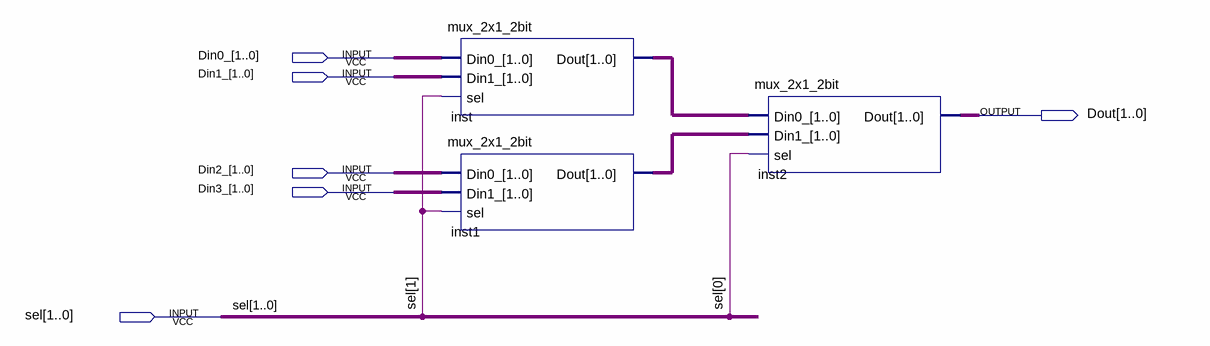
[diagram p0: schematic sheet]
// Quartus schematic mux_4x1_2bit.bdf as structural Verilog: 3 symbols, 6 pins
module mux_4x1_2bit (
  input  [1:0] Din0_,
  input  [1:0] Din1_,
  input  [1:0] Din2_,
  input  [1:0] Din3_,
  input  [1:0] sel,
  output [1:0] Dout
);

  wire [1:0] inst1_dout, inst_dout;

  mux_2x1_2bit inst (.Din0_(Din0_), .Din1_(Din1_), .sel(sel[1]), .Dout(inst_dout));
  mux_2x1_2bit inst1 (.Din0_(Din2_), .Din1_(Din3_), .sel(sel[1]), .Dout(inst1_dout));
  mux_2x1_2bit inst2 (.Din0_(inst_dout), .Din1_(inst1_dout), .sel(sel[0]), .Dout(Dout));
endmodule
